# Altium schematic sheet MainBoard_V100_MCU.SchDoc
size A4 portrait; SheetNumber: 18; SheetTotal: 22; Title_: MCU
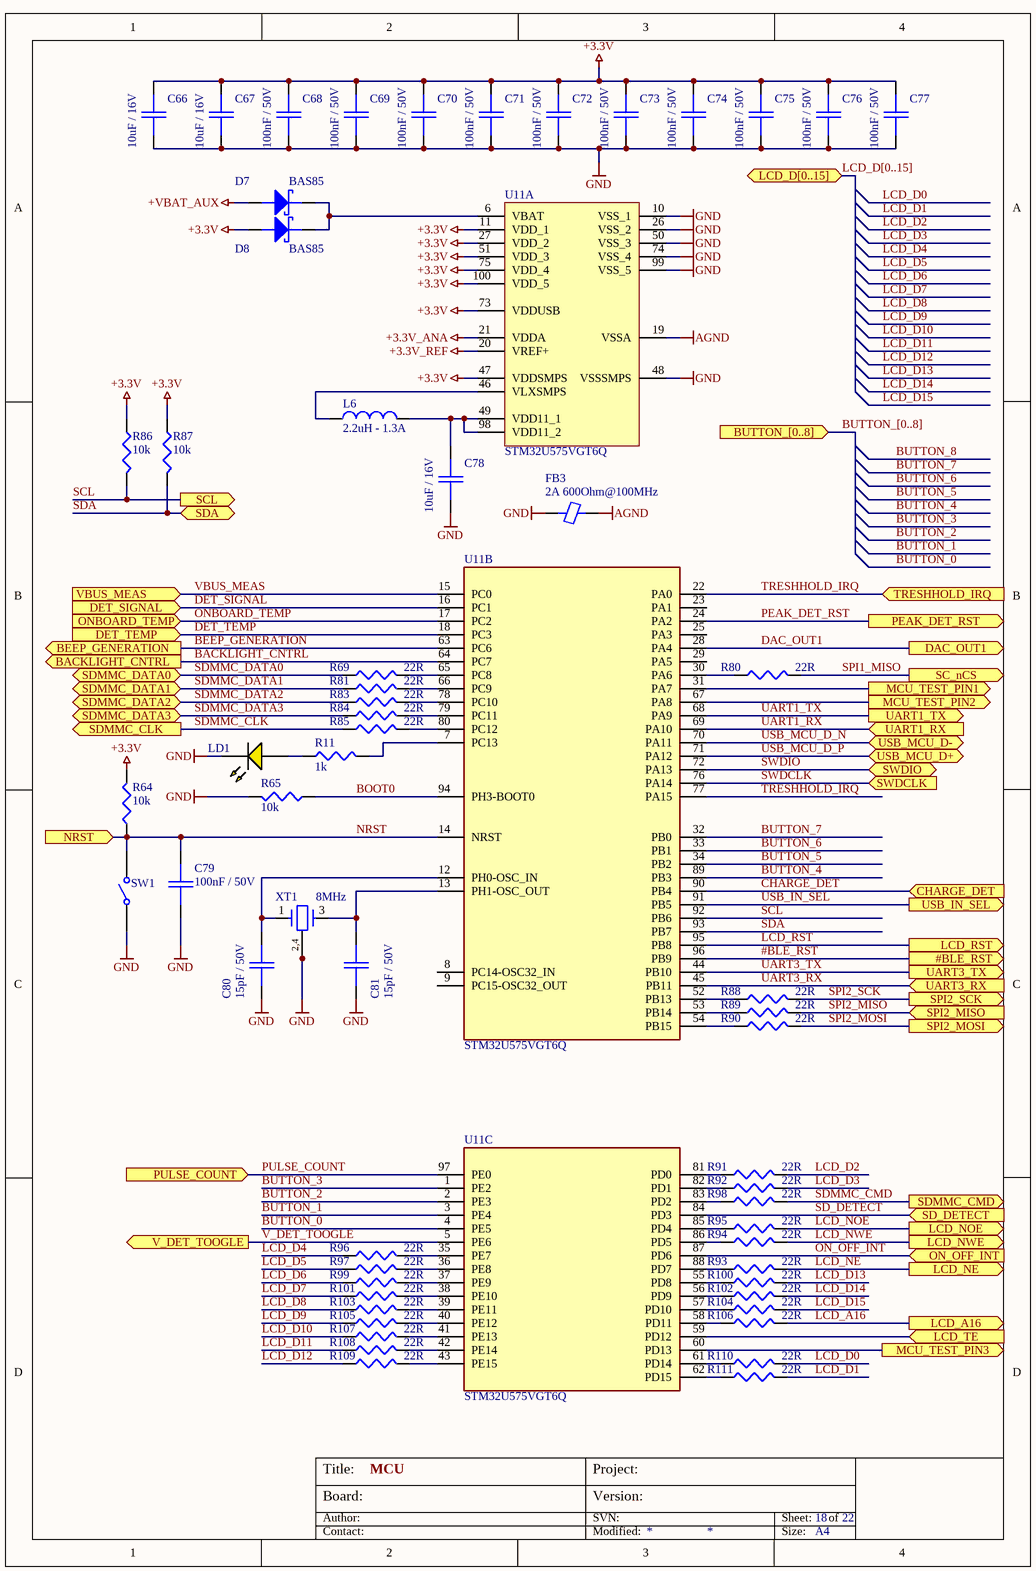
[diagram p0: MainBoard_V100_MCU.SchDoc]

## Parts
C66  10uF / 16V  [0805_C]
C67  10uF / 16V  [0805_C]
C68  100nF / 50V  [0805_C]
C69  100nF / 50V  [0805_C]
C70  100nF / 50V  [0805_C]
C71  100nF / 50V  [0805_C]
C72  100nF / 50V  [0805_C]
C73  100nF / 50V  [0805_C]
C74  100nF / 50V  [0805_C]
C75  100nF / 50V  [0805_C]
C76  100nF / 50V  [0805_C]
C77  100nF / 50V  [0805_C]
C78  10uF / 16V  [0805_C]
C79  100nF / 50V  [0805_C]
C80  15pF / 50V  [0805_C]
C81  15pF / 50V  [0805_C]
D7  BAS85  [SOD80]
D8  BAS85  [SOD80]
FB3  2A 600Ohm@100MHz  [0805_FB]
L6  2.2uH - 1.3A  [0805]
LD1  HSMY-C110 (YEL)  [LED_SMD_90DEG_YEL]  (value not drawn)
R11  1k  [0805]
R64  10k  [0805]
R65  10k  [0603]
R69  22R  [0603]
R80  22R  [0603]
R81  22R  [0603]
R83  22R  [0603]
R84  22R  [0603]
R85  22R  [0603]
R86  10k  [0805]
R87  10k  [0805]
R88  22R  [0603]
R89  22R  [0603]
R90  22R  [0603]
R91  22R  [0603]
R92  22R  [0603]
R93  22R  [0603]
R94  22R  [0603]
R95  22R  [0603]
R96  22R  [0603]
R97  22R  [0603]
R98  22R  [0603]
R99  22R  [0603]
R100  22R  [0603]
R101  22R  [0603]
R102  22R  [0603]
R103  22R  [0603]
R104  22R  [0603]
R105  22R  [0603]
R106  22R  [0603]
R107  22R  [0603]
R108  22R  [0603]
R109  22R  [0603]
R110  22R  [0603]
R111  22R  [0603]
SW1  SW_WE_430181038816  [SW_WE_430181038816]  (value not drawn)
U11  STM32U575VGT6Q  [TQFP-100]  (parts A,B,C of 3)
XT1  8MHz  [XTAL_4pin_5x3.2mm]

## Ports
#BLE_RST (out), BACKLIGHT_CNTRL (out), BEEP_GENERATION (out), BUTTON_[0..8] (in), CHARGE_DET (in), DAC_OUT1 (out), DET_SIGNAL (in), DET_TEMP (in), LCD_A16 (out), LCD_D[0..15] (bidir), LCD_NE (out), LCD_NOE (out), LCD_NWE (out), LCD_RST (out), LCD_TE (in), MCU_TEST_PIN1 (out), MCU_TEST_PIN2 (out), MCU_TEST_PIN3 (out), NRST (in), ON_OFF_INT (in), ONBOARD_TEMP (in), PEAK_DET_RST (out), PULSE_COUNT (in), SC_nCS (out), SCL (out), SD_DETECT (in), SDA (bidir), SDMMC_CLK (out), SDMMC_CMD (out), SDMMC_DATA0 (bidir), SDMMC_DATA1 (bidir), SDMMC_DATA2 (bidir), SDMMC_DATA3 (bidir), SPI2_MISO (in), SPI2_MOSI (out), SPI2_SCK (out), SWDCLK (in), SWDIO (bidir), TRESHHOLD_IRQ (in), UART1_RX (in), UART1_TX (out), UART3_RX (in), UART3_TX (out), USB_IN_SEL (out), USB_MCU_D+ (bidir), USB_MCU_D- (bidir), V_DET_TOOGLE (out), VBUS_MEAS (in)

## Nets
+3.3V: C66.2 C67.2 C68.1 C69.1 C70.1 C71.1 C72.1 C73.1 C74.1 C75.1 C76.1 C77.1 D8.A R64.2 R86.1 R87.1 U11.11(VDD_1) U11.27(VDD_2) U11.47(VDDSMPS) U11.51(VDD_3) U11.73(VDDUSB) U11.75(VDD_4) U11.100(VDD_5)
+3.3V_ANA: U11.21(VDDA)
+3.3V_REF: U11.20(VREF+)
+VBAT_AUX: D7.A
AGND: FB3.2 U11.19(VSSA)
GND: C66.1 C67.1 C68.2 C69.2 C70.2 C71.2 C72.2 C73.2 C74.2 C75.2 C76.2 C77.2 C78.1 C79.2 C80.2 C81.2 FB3.1 LD1.K R65.2 SW1.1 U11.10(VSS_1) U11.26(VSS_2) U11.48(VSSSMPS) U11.50(VSS_3) U11.74(VSS_4) U11.99(VSS_5) XT1.2 XT1.4
#BLE_RST: U11.96(PB9) ; port #BLE_RST
BACKLIGHT_CNTRL: U11.64(PC7) ; port BACKLIGHT_CNTRL
BEEP_GENERATION: U11.63(PC6) ; port BEEP_GENERATION
BOOT0: R65.1 U11.94(PH3-BOOT0)
BUTTON_0: U11.4(PE5)
BUTTON_1: U11.3(PE4)
BUTTON_2: U11.2(PE3)
BUTTON_3: U11.1(PE2)
BUTTON_4: U11.89(PB3)
BUTTON_5: U11.34(PB2)
BUTTON_6: U11.33(PB1)
BUTTON_7: U11.32(PB0)
CHARGE_DET: U11.90(PB4) ; port CHARGE_DET
DAC_OUT1: U11.28(PA4) ; port DAC_OUT1
DET_SIGNAL: U11.16(PC1) ; port DET_SIGNAL
DET_TEMP: U11.18(PC3) ; port DET_TEMP
LCD_A16: R106.2 ; port LCD_A16
LCD_D0: R110.2
LCD_D1: R111.2
LCD_D2: R91.2
LCD_D3: R92.2
LCD_D4: R96.1
LCD_D5: R97.1
LCD_D6: R99.1
LCD_D7: R101.1
LCD_D8: R103.1
LCD_D9: R105.1
LCD_D10: R107.1
LCD_D11: R108.1
LCD_D12: R109.1
LCD_D13: R100.2
LCD_D14: R102.2
LCD_D15: R104.2
LCD_NE: R93.2 ; port LCD_NE
LCD_NOE: R95.2 ; port LCD_NOE
LCD_NWE: R94.2 ; port LCD_NWE
LCD_RST: U11.95(PB8) ; port LCD_RST
LCD_TE: U11.59(PD12) ; port LCD_TE
MCU_TEST_PIN1: U11.31(PA7) ; port MCU_TEST_PIN1
MCU_TEST_PIN2: U11.67(PA8) ; port MCU_TEST_PIN2
MCU_TEST_PIN3: U11.60(PD13) ; port MCU_TEST_PIN3
NRST: C79.1 R64.1 SW1.2 U11.14(NRST) ; port NRST
ON_OFF_INT: U11.87(PD6) ; port ON_OFF_INT
ONBOARD_TEMP: U11.17(PC2) ; port ONBOARD_TEMP
PEAK_DET_RST: U11.24(PA2) ; port PEAK_DET_RST
PULSE_COUNT: U11.97(PE0) ; port PULSE_COUNT
SCL: R86.2 U11.92(PB6) ; port SCL
SD_DETECT: U11.84(PD3) ; port SD_DETECT
SDA: R87.2 U11.93(PB7) ; port SDA
SDMMC_CLK: R85.1 ; port SDMMC_CLK
SDMMC_CMD: R98.2 ; port SDMMC_CMD
SDMMC_DATA0: R69.1 ; port SDMMC_DATA0
SDMMC_DATA1: R81.1 ; port SDMMC_DATA1
SDMMC_DATA2: R83.1 ; port SDMMC_DATA2
SDMMC_DATA3: R84.1 ; port SDMMC_DATA3
SPI1_MISO: R80.2 ; port SC_nCS
SPI2_MISO: R89.2 ; port SPI2_MISO
SPI2_MOSI: R90.2 ; port SPI2_MOSI
SPI2_SCK: R88.2 ; port SPI2_SCK
SWDCLK: U11.76(PA14) ; port SWDCLK
SWDIO: U11.72(PA13) ; port SWDIO
TRESHHOLD_IRQ: U11.22(PA0) U11.77(PA15) ; port TRESHHOLD_IRQ
UART1_RX: U11.69(PA10) ; port UART1_RX
UART1_TX: U11.68(PA9) ; port UART1_TX
UART3_RX: U11.45(PB11) ; port UART3_RX
UART3_TX: U11.44(PB10) ; port UART3_TX
USB_IN_SEL: U11.91(PB5) ; port USB_IN_SEL
USB_MCU_D_N: U11.70(PA11) ; port USB_MCU_D-
USB_MCU_D_P: U11.71(PA12) ; port USB_MCU_D+
V_DET_TOOGLE: U11.5(PE6) ; port V_DET_TOOGLE
VBUS_MEAS: U11.15(PC0) ; port VBUS_MEAS
NetC78_2: C78.2 L6.2 U11.49(VDD11_1) U11.98(VDD11_2)
NetC80_1: C80.1 U11.12(PH0-OSC_IN) XT1.1
NetC81_1: C81.1 U11.13(PH1-OSC_OUT) XT1.3
NetD7_K: D7.K D8.K U11.6(VBAT)
NetL6_1: L6.1 U11.46(VLXSMPS)
NetLD1_A: LD1.A R11.1
NetR11_2: R11.2 U11.7(PC13)
NetR69_2: R69.2 U11.65(PC8)
NetR80_1: R80.1 U11.30(PA6)
NetR81_2: R81.2 U11.66(PC9)
NetR83_2: R83.2 U11.78(PC10)
NetR84_2: R84.2 U11.79(PC11)
NetR85_2: R85.2 U11.80(PC12)
NetR88_1: R88.1 U11.52(PB13)
NetR89_1: R89.1 U11.53(PB14)
NetR90_1: R90.1 U11.54(PB15)
NetR91_1: R91.1 U11.81(PD0)
NetR92_1: R92.1 U11.82(PD1)
NetR93_1: R93.1 U11.88(PD7)
NetR94_1: R94.1 U11.86(PD5)
NetR95_1: R95.1 U11.85(PD4)
NetR96_2: R96.2 U11.35(PE7)
NetR97_2: R97.2 U11.36(PE8)
NetR98_1: R98.1 U11.83(PD2)
NetR99_2: R99.2 U11.37(PE9)
NetR100_1: R100.1 U11.55(PD8)
NetR101_2: R101.2 U11.38(PE10)
NetR102_1: R102.1 U11.56(PD9)
NetR103_2: R103.2 U11.39(PE11)
NetR104_1: R104.1 U11.57(PD10)
NetR105_2: R105.2 U11.40(PE12)
NetR106_1: R106.1 U11.58(PD11)
NetR107_2: R107.2 U11.41(PE13)
NetR108_2: R108.2 U11.42(PE14)
NetR109_2: R109.2 U11.43(PE15)
NetR110_1: R110.1 U11.61(PD14)
NetR111_1: R111.1 U11.62(PD15)

Not connected (* = marked no-connect by the designer): U11 8(PC14-OSC32_IN) 9(PC15-OSC32_OUT) 23(PA1) 25(PA3) 29(PA5)

## Buses and harness runs
bus BUTTON_[0..8] = port BUTTON_[0..8]
bus LCD_D[0..15] = port LCD_D[0..15]

## Notes on the sheet
- Board:
- Author:
- Title:
- Project:
- SVN:
- Version:
- Sheet:
- of
- Contact:
- Modified:
- Size:
- A4
- (in symbol 253) 2,4

## Library data of the parts
C66 C67 C78 = 153: 10uF 16V X5R; Part Number: SMD0805-10uF-16V; Azonosító: 153; Category: Passives; Subcategory: PASS_Capacitor; Supplier 1: HESTORE; Supplier 1 order number: 100.344.52
C68-C77 C79 = 149: 100nF 50V X7R; Part Number: SMD0805-100nF-50V; Azonosító: 149; Category: Passives; Subcategory: PASS_Capacitor; Supplier 1: HESTORE; Supplier 1 order number: 100.011.22
C80 C81 = 135: 15 pF 50V NP0; Part Number: SMD0805-15pF-50V; Azonosító: 135; Category: Passives; Subcategory: PASS_Capacitor; Supplier 1: HESTORE; Supplier 1 order number: 100.011.25
D7 D8 = 371: Small Signal Schottky Diode, Single, 30 V, 200 mA,  125 °C; Azonosító: 371; Part Number: BAS85; Category: Semiconductors; Subcategory: SEMI_Schottky; Supplier 1: HESTORE; Supplier 1 order number: 100.222.42; Supplier 2: FARNELL; Supplier 2 order number: 1097282; Help URL: https://4donline.ihs.com/images/VipMasterIC/IC/NEXP/NEXP-S-A0002881467/NEXP-S-A0002882622-1.pdf?hkey=6D3A4C79FDBF58556ACFDE234799DDF0
FB3 = 183: Ferrite bead 2A 600Ohm@100MHz; Part Number: LCBB-601 SMD; Azonosító: 183; Category: Passives; Subcategory: PASS_Other; Supplier 1: HESTORE; Supplier 1 order number: 100.327.86
L6 = 393: 2.2uH -20% 1.3A; Part Number: LQM21PN2R2MGHL; Azonosító: 393; Category: Passives; Subcategory: PASS_Inductor; Supplier 1: MOUSER; Supplier 1 order number: 81-LQM21PN2R2MGHL; Help URL: https://hu.mouser.com/datasheet/2/281/1/JELF243B_0040-1699501.pdf
LD1 = 291: LED, Yellow, SMD, 20 mA, 2.1 V, 586 nm; Azonosító: 291; Part Number: HSMY-C110; Category: Optoelectronics; Subcategory: OPTO_LED; Supplier 1: MOUSER; Supplier 1 order number: 630-HSMY-C110; Supplier 2: FARNELL; Supplier 2 order number: 3229579; Help URL: https://hu.mouser.com/datasheet/2/678/AV02_0551EN_DS_HSMx_Cxxx_25Mar2022-1827675.pdf
R11 = 52: 1k 0805 0.125W 1%; Part Number: SMD0805-1k 1%; Azonosító: 52; Category: Passives; Subcategory: PASS_Resistor; Supplier 1: HESTORE; Supplier 1 order number: 100.312.99
R64 R86 R87 = 59: 10k 0805 0.125W 1%; Part Number: SMD0805-10k 1%; Azonosító: 59; Category: Passives; Subcategory: PASS_Resistor; Supplier 1: HESTORE; Supplier 1 order number: 100.403.38
R65 = 23: 10k 0603 0.1W 1%; Part Number: SMD0603-10K-1%; Azonosító: 23; Category: Passives; Subcategory: PASS_Resistor; Supplier 1: HESTORE; Supplier 1 order number: 100.239.10
R69 R80 R81 R83-R85 R88-R111 = 10: 22R 0603 0.1W 5%; Part Number: SMD0603-22R-5%; Azonosító: 10; Category: Passives; Subcategory: PASS_Resistor; Supplier 1: HESTORE; Supplier 1 order number: 100.239.27; Help URL: https://www.hestore.hu/prod_getfile.php?id=306
SW1 = 281: SW_WE_430181038816 Tact switch 2 pole; Azonosító: 281; Part Number: WE_430181038816; Category: Electro-mechanicals; Subcategory: ELME_Other Switch; Supplier 1: MOUSER; Supplier 1 order number: 710-430181038816; Supplier 2: DIGIKEY; Supplier 2 order number: 732-7003-1-ND; Help URL: https://www.we-online.com/components/products/datasheet/430181038816.pdf
U11 = 374: ARM® Cortex®-M33 STM32U5 Mikrovezérlő IC 32 bites 160MHz 1MB (1M x 8) FLASH 100-LQFP (14x14); Azonosító: 374; Part Number: STM32U575VGT6Q; Category: Integrated Circuits; Subcategory: IC_MCU-FPGA-DSP; Supplier 1: MOUSER; Supplier 1 order number: 511-STM32U575VGT6Q
XT1 = 253: ABRACON  ABM3B-8.000MHZ-10-1UT  Crystal, 8 MHz, SMD, 5mm x 3.2mm, 10 ppm,18 pF 20 ppm, ABM3B Series 8MHz; Azonosító: 253; Part Number: ABM3B-8.000MHZ-10-1UT; Category: Clock Sources; Subcategory: CLOC_Crystal; Supplier 1: MOUSER; Supplier 1 order number: 815-ABM3B-8.0-10-1UT; Supplier 2: DIGIKEY; Supplier 2 order number: 535-9721-1-ND; Help URL: https://hu.mouser.com/datasheet/2/3/abm3b-1774998.pdf